# EasyEDA Pro project G-CU ver 2.3.C.eprj, schematic Schematic1
Board Name: Board1; Create Date: 2024-10-28; Page Name: P1; Project Name: G-CU ver 2.3.C; Schematic Name: Schematic1; Update Date: 2024-10-28; Company: 嘉立创EDA; Page Size: A4; Version: V1.0
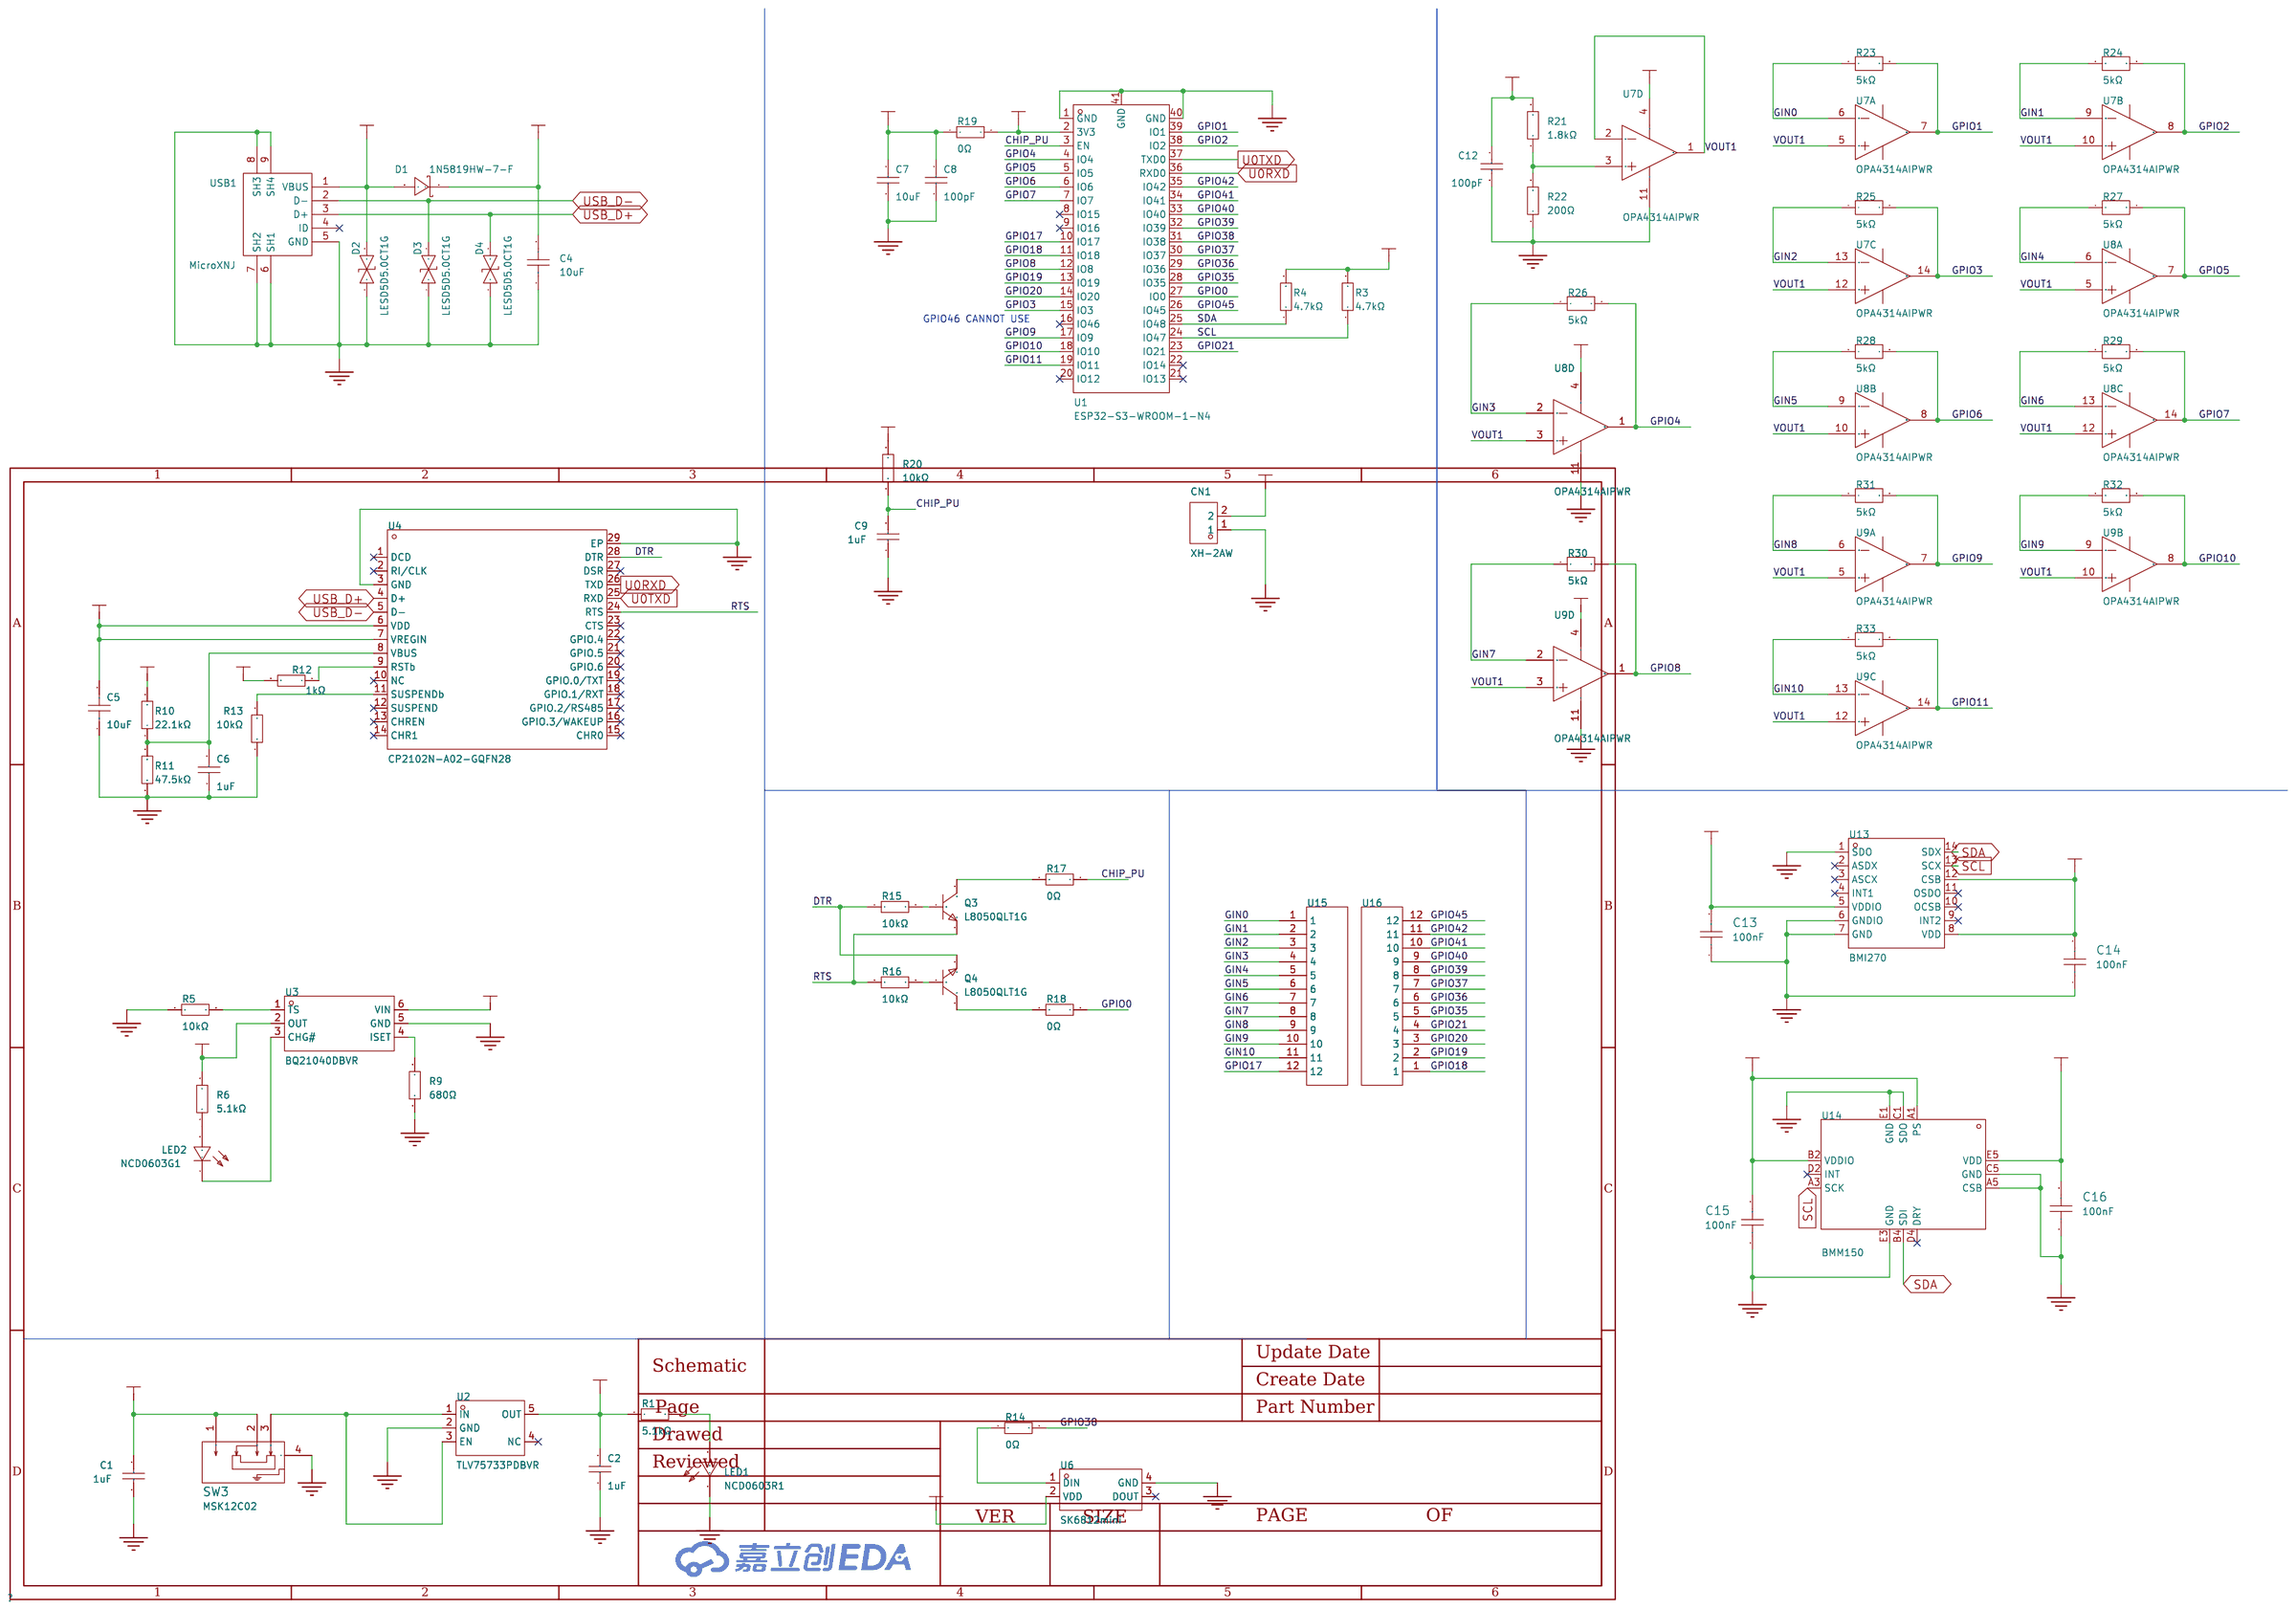
[diagram p0: schematic sheet]

## Parts
C1  1uF  [C0402]
C2  1uF  [C0402]
C4  10uF  [C0603]
C5  10uF  [C0603]
C6  1uF  [C0603]
C7  10uF  [C0402]
C8  100pF  [C0402]
C9  1uF  [C0402]
C12  100pF  [C0402]
C13  100nF  [C0402]
C14  100nF  [C0402]
C15  100nF  [C0402]
C16  100nF  [C0402]
CN1  XH-2AW  [CONN-TH_XH-2AW_C2908611]
D1  1N5819HW-7-F  [SOD-123_L2.7-W1.6-LS3.7-RD]
D2  LESD5D5.0CT1G  [SOD-523_L1.2-W0.8-LS1.6-BI]
D3  LESD5D5.0CT1G  [SOD-523_L1.2-W0.8-LS1.6-BI]
D4  LESD5D5.0CT1G  [SOD-523_L1.2-W0.8-LS1.6-BI]
LED1  NCD0603R1  [LED0603-RD_RED]
LED2  NCD0603G1  [LED0603-RD]
Q3  L8050QLT1G  [SOT-23-3_L2.9-W1.3-P1.90-LS2.4-BR]
Q4  L8050QLT1G  [SOT-23-3_L2.9-W1.3-P1.90-LS2.4-BR]
R1  5.1kΩ  [R0402]
R3  4.7kΩ  [R0402]
R4  4.7kΩ  [R0402]
R5  10kΩ  [R0402]
R6  5.1kΩ  [R0402]
R9  680Ω  [R0402]
R10  22.1kΩ  [R0402]
R11  47.5kΩ  [R0402]
R12  1kΩ  [R0402]
R13  10kΩ  [R0402]
R14  0Ω  [R0402]
R15  10kΩ  [R0402]
R16  10kΩ  [R0402]
R17  0Ω  [R0402]
R18  0Ω  [R0402]
R19  0Ω  [R0402]
R20  10kΩ  [R0402]
R21  1.8kΩ  [R0402]
R22  200Ω  [R0402]
R23  5kΩ  [R0805]
R24  5kΩ  [R0805]
R25  5kΩ  [R0805]
R26  5kΩ  [R0805]
R27  5kΩ  [R0805]
R28  5kΩ  [R0805]
R29  5kΩ  [R0805]
R30  5kΩ  [R0805]
R31  5kΩ  [R0805]
R32  5kΩ  [R0805]
R33  5kΩ  [R0805]
SW3  MSK12C02  [SW-TH_MSK12C02]
U1  ESP32-S3-WROOM-1-N4  [WIRELM-SMD_ESP32-S3-WROOM-1]
U2  TLV75733PDBVR  [SOT-23-5_L2.9-W1.6-P0.95-LS2.8-BL]
U3  BQ21040DBVR  [SOT-23-6_L2.9-W1.6-P0.95-LS2.8-BR]
U4  CP2102N-A02-GQFN28  [QFN-28_L5.0-W5.0-P0.50-TL-EP3.3]
U6  SK6812mini  [LED-SMD_4P-L3.7-W3.5-P1.75-BR-SK6812MINI]
U7  OPA4314AIPWR  [TSSOP-14_L5.0-W4.4-P0.65-LS6.4-BL]  (sections 1,2,3,4)
U8  OPA4314AIPWR  [TSSOP-14_L5.0-W4.4-P0.65-LS6.4-BL]  (sections 1,2,3,4)
U9  OPA4314AIPWR  [TSSOP-14_L5.0-W4.4-P0.65-LS6.4-BL]  (sections 1,2,3,4)
U13  BMI270  [LGA-14_L3.0-W2.5-P0.50-BR]
U14  BMM150  [WLCSP-12_L1.6-W1.6_BMM150]
U15  -  [GCU-CON ver 1.1.C]
U16  -  [GCU-CON ver 1.1.C]
USB1  MicroXNJ  [MICRO-USB-SMD_MICROXNJ]

## Library data of the parts
C1 C2 C9 = CL05A105KP5NNNC: 容值:1uF;精度:±10%;额定电压:10V;材质(温度系数):X5R;; LCSC Part Name: 1uF ±10% 10V; Supplier Part: C14445; Manufacturer: SAMSUNG(三星); Supplier Footprint: 0402; JLCPCB Part Class: Extended Part; Datasheet: https://atta.szlcsc.com/upload/public/pdf/source/20160103/1457707670698.pdf; Supplier: LCSC; Tolerance: ±10%; Voltage Rated: 10V; Temperature Coefficient: X5R
C4 C5 = CL10A106MA8NRNC: 容值:10uF;精度:±20%;额定电压:25V;材质(温度系数):X5R;; LCSC Part Name: 10uF ±20% 25V; Supplier Part: C96446; Manufacturer: SAMSUNG(三星); Supplier Footprint: 0603; JLCPCB Part Class: Basic Part; Datasheet: https://atta.szlcsc.com/upload/public/pdf/source/20170325/1490427913016.pdf; Supplier: LCSC; Tolerance: ±20%; Voltage Rated: 25V; Temperature Coefficient: X5R
C6 = CL10A105KO8NNNC: 容值:1uF;精度:±10%;额定电压:16V;材质(温度系数):X5R;; LCSC Part Name: 1uF ±10% 16V; Supplier Part: C1592; Manufacturer: SAMSUNG(三星); Supplier Footprint: 0603; JLCPCB Part Class: Extended Part; Datasheet: https://atta.szlcsc.com/upload/public/pdf/source/20220919/9FBE606BE0D9532D730F292EB26DC5BB.pdf; Supplier: LCSC; Tolerance: ±10%; Voltage Rated: 16V; Temperature Coefficient: X5R
C7 = CL05A106MQ5NUNC: 容值:10uF;精度:±20%;额定电压:6.3V;材质(温度系数):X5R;; LCSC Part Name: 10uF ±20% 6.3V; Supplier Part: C15525; Manufacturer: SAMSUNG(三星); Supplier Footprint: 0402; JLCPCB Part Class: Basic Part; Datasheet: https://atta.szlcsc.com/upload/public/pdf/source/20220823/2B02EE04F8F211D38A52DCB16EB6BEBA.pdf; Supplier: LCSC; Tolerance: ±20%; Voltage Rated: 6.3V; Temperature Coefficient: X5R
C8 C12 = 0402CG101J500NT: 容值:100pF;精度:±5%;额定电压:50V;材质(温度系数):C0G;; LCSC Part Name: 100pF ±5% 50V; Supplier Part: C1546; Manufacturer: FH(风华); Supplier Footprint: 0402; JLCPCB Part Class: Basic Part; Datasheet: https://atta.szlcsc.com/upload/public/pdf/source/20170923/C1546_1506149265265988353.pdf; Supplier: LCSC; Tolerance: ±5%; Voltage Rated: 50V; Temperature Coefficient: C0G
C13-C16 = FCC0402B104K250AT: 容值:100nF;精度:±10%;额定电压:25V;材质(温度系数):X7R;; LCSC Part Name: 100nF ±10% 25V; Supplier Part: C5137489; Manufacturer: FOJAN(富捷); Supplier Footprint: 0402; JLCPCB Part Class: 扩展库; Datasheet: https://atta.szlcsc.com/upload/public/pdf/source/20220818/0EB3B7FB2F5648AC16609637FBA7DABE.pdf; Supplier: LCSC; Tolerance: ±10%; Voltage Rated: 25V; Temperature Coefficient: X7R
CN1 = XH-2AW_C2908611: 参考系列:XH;间距:2.54mm;插针结构:1x2P;排数:1;每排PIN数:2;行距:-;公母:公型插针;安装方式:弯插;额定电流:3A;工作温度范围:-25℃~+85℃;; LCSC Part Name: XH 2.54mm 1x2P 弯插; Supplier Part: C2908611; Manufacturer: HCTL(华灿天禄); Supplier Footprint: 弯插,P=2.54mm; JLCPCB Part Class: 扩展库; Datasheet: https://atta.szlcsc.com/upload/public/pdf/source/20211021/ACA2D54D99493880102FCACAC8DAABA8.pdf; Supplier: LCSC; Reference Series: XH; Pitch: 2.54mm; Pins Structure: 1x2P; Number of Rows: 1; Number of PINs Per Row: 2; Gender: 公型插针; Mounting Style: 弯插; Current Rating (Max): 3A; Operating Temperature Range: -25℃~+85℃
D1 = 1N5819HW-7-F: 直流反向耐压(Vr):40V;平均整流电流(Io):1A;正向压降(Vf):450mV@1A;; LCSC Part Name: 40V 1A 450mV@1A; Supplier Part: C82544; Manufacturer: DIODES(美台); Supplier Footprint: SOD-123; JLCPCB Part Class: Extended Part; Datasheet: https://atta.szlcsc.com/upload/public/pdf/source/20161024/1477288459223.pdf; Supplier: LCSC; Reverse Voltage (Vr): 40V; Average Rectified Current (Io): 1A; Forward Voltage (Vf@If): 450mV@1A
D2-D4 = LESD5D5.0CT1G: 极性:双向;反向截止电压(Vrwm):5V;击穿电压(VBR):5.6V;钳位电压(Vc)@Ipp:18.6V;; LCSC Part Name: 双向ESD; Supplier Part: C383211; Manufacturer: LRC(乐山无线电); Supplier Footprint: SOD-523; JLCPCB Part Class: Extended Part; Datasheet: https://atta.szlcsc.com/upload/public/pdf/source/20190807/C383211_633DF4B4E2C161403226E5235FE33A1C.pdf; Supplier: LCSC; Polarity: 双向; Reverse Stand-Off Voltage (Vrwm): 5V; Breakdown Voltage (VBR): 5.6V; Peak Pulse Current(Ipp)@8/20us: 9.4A; Clamping Voltage@Ipp: 18.6V
LED1 = NCD0603R1_C84263: 发光颜色:红灯;; LCSC Part Name: 红灯; Supplier Part: C84263; Manufacturer: 国星光电; Supplier Footprint: 0603; JLCPCB Part Class: Extended Part; Datasheet: https://atta.szlcsc.com/upload/public/pdf/source/20200820/C84263_DABC6A75E58F576973B407FDBA283D60.pdf; Supplier: LCSC; Emitted Color: 红灯
LED2 = NCD0603G1: 发光颜色:翠绿;; LCSC Part Name: 翠绿; Supplier Part: C84267; Manufacturer: 国星光电; Supplier Footprint: 0603; JLCPCB Part Class: Extended Part; Datasheet: https://atta.szlcsc.com/upload/public/pdf/source/20200820/C84267_04BA7703640BAC111D09F5EFB971FBF3.pdf; Supplier: LCSC; Emitted Color: 翠绿
Q3 Q4 = L8050QLT1G: 晶体管类型:NPN;集射极击穿电压(Vceo):25V;集电极电流(Ic):800mA;功率(Pd):225mW;; LCSC Part Name: NPN 25V 800mA; Supplier Part: C49581; Manufacturer: LRC(乐山无线电); Supplier Footprint: SOT-23; JLCPCB Part Class: Extended Part; Datasheet: https://atta.szlcsc.com/upload/public/pdf/source/20150518/1457707314424.pdf; Supplier: LCSC; Transistor Type: NPN; Collector-Emitter Breakdown Voltage (Vceo): 25V; Collector Current (Ic): 800mA; Power Dissipation (Pd): 225mW
R1 R6 = 0402WGF5101TCE: 电阻类型:厚膜电阻;阻值:5.1kΩ;精度:±1%;功率:62.5mW;; LCSC Part Name: 5.1kΩ ±1% 62.5mW; Supplier Part: C25905; Manufacturer: UNI-ROYAL(厚声); Supplier Footprint: 0402; JLCPCB Part Class: Basic Part; Datasheet: https://atta.szlcsc.com/upload/public/pdf/source/20200306/C422600_1E6D84923E4A46A82E41ADD87F860B5C.pdf; Supplier: LCSC; Type: 厚膜电阻; Tolerance: ±1%; Power(Watts): 62.5mW; Temperature Coefficient: ±100ppm/℃; Overload Voltage (Max): 50V; Operating Temperature Range: -55℃~+155℃
R3 R4 = 0402WGF4701TCE: 电阻类型:厚膜电阻;阻值:4.7kΩ;精度:±1%;功率:62.5mW;; LCSC Part Name: 4.7kΩ ±1% 62.5mW; Supplier Part: C25900; Manufacturer: UNI-ROYAL(厚声); Supplier Footprint: 0402; JLCPCB Part Class: Basic Part; Datasheet: https://atta.szlcsc.com/upload/public/pdf/source/20200306/C422600_1E6D84923E4A46A82E41ADD87F860B5C.pdf; Supplier: LCSC; Type: 厚膜电阻; Tolerance: ±1%; Power(Watts): 62.5mW; Temperature Coefficient: ±100ppm/℃; Overload Voltage (Max): 50V; Operating Temperature Range: -55℃~+155℃
R5 R13 R15 R16 R20 = 0402WGF1002TCE: 电阻类型:厚膜电阻;阻值:10kΩ;精度:±1%;功率:62.5mW;; LCSC Part Name: 10kΩ ±1% 62.5mW; Supplier Part: C25744; Manufacturer: UNI-ROYAL(厚声); Supplier Footprint: 0402; JLCPCB Part Class: Basic Part; Datasheet: https://atta.szlcsc.com/upload/public/pdf/source/20200306/C422600_1E6D84923E4A46A82E41ADD87F860B5C.pdf; Supplier: LCSC; Type: 厚膜电阻; Tolerance: ±1%; Power(Watts): 62.5mW; Temperature Coefficient: ±100ppm/℃; Overload Voltage (Max): 50V; Operating Temperature Range: -55℃~+155℃
R9 = 0402WGF6800TCE: 电阻类型:厚膜电阻;阻值:680Ω;精度:±1%;功率:62.5mW;; LCSC Part Name: 680Ω ±1% 62.5mW; Supplier Part: C25130; Manufacturer: UNI-ROYAL(厚声); Supplier Footprint: 0402; JLCPCB Part Class: Basic Part; Datasheet: https://atta.szlcsc.com/upload/public/pdf/source/20200306/C422600_1E6D84923E4A46A82E41ADD87F860B5C.pdf; Supplier: LCSC; Type: 厚膜电阻; Tolerance: ±1%; Power(Watts): 62.5mW; Temperature Coefficient: ±100ppm/℃; Overload Voltage (Max): 50V; Operating Temperature Range: -55℃~+155℃
R10 = 0402WGF2212TCE: 电阻类型:厚膜电阻;阻值:22.1kΩ;精度:±1%;功率:62.5mW;; LCSC Part Name: 22.1kΩ ±1% 62.5mW; Supplier Part: C43473; Manufacturer: UNI-ROYAL(厚声); Supplier Footprint: 0402; JLCPCB Part Class: Extended Part; Datasheet: https://atta.szlcsc.com/upload/public/pdf/source/20200306/C422600_1E6D84923E4A46A82E41ADD87F860B5C.pdf; Supplier: LCSC; Type: 厚膜电阻; Tolerance: ±1%; Power(Watts): 62.5mW; Temperature Coefficient: ±100ppm/℃; Overload Voltage (Max): 50V; Operating Temperature Range: -55℃~+155℃
R11 = 0402WGF4752TCE: 电阻类型:厚膜电阻;阻值:47.5kΩ;精度:±1%;功率:62.5mW;; LCSC Part Name: 47.5kΩ ±1% 62.5mW; Supplier Part: C25896; Manufacturer: UNI-ROYAL(厚声); Supplier Footprint: 0402; JLCPCB Part Class: Extended Part; Datasheet: https://atta.szlcsc.com/upload/public/pdf/source/20200306/C422600_1E6D84923E4A46A82E41ADD87F860B5C.pdf; Supplier: LCSC; Type: 厚膜电阻; Tolerance: ±1%; Power(Watts): 62.5mW; Temperature Coefficient: ±100ppm/℃; Overload Voltage (Max): 50V; Operating Temperature Range: -55℃~+155℃
R12 = 0402WGF1001TCE: 电阻类型:厚膜电阻;阻值:1kΩ;精度:±1%;功率:62.5mW;; LCSC Part Name: 1kΩ ±1% 62.5mW; Supplier Part: C11702; Manufacturer: UNI-ROYAL(厚声); Supplier Footprint: 0402; JLCPCB Part Class: Basic Part; Datasheet: https://atta.szlcsc.com/upload/public/pdf/source/20200306/C422600_1E6D84923E4A46A82E41ADD87F860B5C.pdf; Supplier: LCSC; Type: 厚膜电阻; Tolerance: ±1%; Power(Watts): 62.5mW; Temperature Coefficient: ±100ppm/℃; Overload Voltage (Max): 50V; Operating Temperature Range: -55℃~+155℃
R14 R17-R19 = 0402WGJ0000TCE: 电阻类型:厚膜电阻;阻值:0Ω;精度:±5%;功率:62.5mW;; LCSC Part Name: 0Ω ±5% 62.5mW; Supplier Part: C21376; Manufacturer: UNI-ROYAL(厚声); Supplier Footprint: 0402; JLCPCB Part Class: Extended Part; Datasheet: https://atta.szlcsc.com/upload/public/pdf/source/20200306/C422600_1E6D84923E4A46A82E41ADD87F860B5C.pdf; Supplier: LCSC; Type: 厚膜电阻; Tolerance: ±5%; Power(Watts): 62.5mW; Overload Voltage (Max): 50V; Operating Temperature Range: -55℃~+155℃
R21 = 0402WGF1801TCE: 电阻类型:厚膜电阻;阻值:1.8kΩ;精度:±1%;功率:62.5mW;; LCSC Part Name: 1.8kΩ ±1% 62.5mW; Supplier Part: C25871; Manufacturer: UNI-ROYAL(厚声); Supplier Footprint: 0402; JLCPCB Part Class: Extended Part; Datasheet: https://atta.szlcsc.com/upload/public/pdf/source/20200306/C422600_1E6D84923E4A46A82E41ADD87F860B5C.pdf; Supplier: LCSC; Type: 厚膜电阻; Tolerance: ±1%; Power(Watts): 62.5mW; Temperature Coefficient: ±100ppm/℃; Overload Voltage (Max): 50V; Operating Temperature Range: -55℃~+155℃
R22 = 0402WGF2000TCE: 电阻类型:厚膜电阻;阻值:200Ω;精度:±1%;功率:62.5mW;; LCSC Part Name: 200Ω ±1% 62.5mW; Supplier Part: C25087; Manufacturer: UNI-ROYAL(厚声); Supplier Footprint: 0402; JLCPCB Part Class: Basic Part; Datasheet: https://atta.szlcsc.com/upload/public/pdf/source/20200306/C422600_1E6D84923E4A46A82E41ADD87F860B5C.pdf; Supplier: LCSC; Type: 厚膜电阻; Tolerance: ±1%; Power(Watts): 62.5mW; Temperature Coefficient: ±100ppm/℃; Overload Voltage (Max): 50V; Operating Temperature Range: -55℃~+155℃
R23-R33 = AR03BTCX5001: 电阻类型:薄膜电阻;阻值:5kΩ;精度:±0.1%;功率:100mW;; LCSC Part Name: 5kΩ ±0.1% 100mW; Supplier Part: C2828621; Manufacturer: Viking(光颉); Supplier Footprint: 0603; JLCPCB Part Class: Extended Part; Datasheet: https://atta.szlcsc.com/upload/public/pdf/source/20211009/C2828621_7F88408CB1D09DFC08036051E0A6050B.pdf; Supplier: LCSC; Type: 薄膜电阻; Tolerance: ±0.1%; Power(Watts): 100mW; Temperature Coefficient: ±25ppm/℃; Overload Voltage (Max): 50V; Operating Temperature Range: -55℃~+155℃
SW3 = MSK12C02: LCSC Part Name: 两档侧拨贴片 7脚 拨动 白柄 柄长1.5mm,带定位柱; Supplier Part: C431540; Manufacturer: SHOU HAN(首韩); Supplier Footprint: SMD; JLCPCB Part Class: 扩展库; Supplier: LCSC
U1 = ESP32-S3-WROOM-1: LCSC Part Name: ESP32-S2-SOLO-2-N4; Supplier Part: C2913197; Manufacturer: ESPRESSIF(乐鑫); JLCPCB Part Class: Extended Part; Datasheet: https://atta.szlcsc.com/upload/public/pdf/source/20220829/68E69EF550BFD22B9418B9E05FF4E453.pdf; Supplier: LCSC
U2 = TLV75733PDBVR: 输出类型:固定;输出极性:正;输出通道数:1;最大输入电压:5.5V;输出电压:3.3V;压差:475mV@(1A);输出电流:1A;电源纹波抑制比(PSRR):52dB;; LCSC Part Name: 正 Vin=5.5V Vout=3.3V 1A 52dB; Supplier Part: C485517; Manufacturer: TI(德州仪器); Supplier Footprint: SOT-23-5; JLCPCB Part Class: Extended Part; Datasheet: https://atta.szlcsc.com/upload/public/pdf/source/20200225/C485517_6B29D09EDAFD9A781E45EE8E3C6E09A4.pdf; Supplier: LCSC; Output Type: 固定; Output Polarity: 正; Number of Outputs: 1; Maximum Input Voltage: 5.5V; Output Voltage: 3.3V; Dropout Voltage: 475mV@(1A); Output Current: 1A; Power Supply Rejection Ratio (PSRR): 52dB
U3 = BQ21040DBVR: 电池类型:锂离子/聚合物;电池节数:1;最大充电电流:800mA;电源电压:6.45V;; Supplier Part: C202311; Manufacturer: TI(德州仪器); Supplier Footprint: SOT-23-6; JLCPCB Part Class: Extended Part; Datasheet: https://atta.szlcsc.com/upload/public/pdf/source/20180412/C202311_69E9FC455D67F52C33ED3C60972DCB90.pdf; Supplier: LCSC; Type of Battery: 锂离子/聚合物; Number of Cells: 1; Maximum Charge Current: 800mA; Supply Voltage: 6.45V; Operating Temperature: 0℃~+125℃
U4 = CP2102N-A02-GQFN28: Supplier Part: C1550553; Manufacturer: SILICON LABS(芯科); Supplier Footprint: QFN-28(5x5); JLCPCB Part Class: Extended Part; Datasheet: https://atta.szlcsc.com/upload/public/pdf/source/20201204/C964632_F2B790CC23A72455AEF523510305B30A.pdf; Supplier: LCSC
U6 = SK6812mini: Supplier Part: C2886570; Manufacturer: 欧思科光电; Supplier Footprint: SMD; JLCPCB Part Class: Extended Part; Datasheet: https://atta.szlcsc.com/upload/public/pdf/source/20230417/4A68877D1EE94768BDE7A1DE8196F30D.pdf; Supplier: LCSC
U7-U9 = OPA4314AIPWR: OPA4314 四路、3MHz、低功耗、低噪声、RRI/O、1.8V CMOS 运算放大器; Supplier Part: C129333; Manufacturer: TI(德州仪器); Supplier Footprint: TSSOP-14; JLCPCB Part Class: Extended Part; Datasheet: https://atta.szlcsc.com/upload/public/pdf/source/20170914/C129333_1505359967979968173.pdf; Supplier: LCSC
U13 = BMI270: IMU-惯性测量单元; Supplier Part: C2836813; Manufacturer: Bosch(博世); Supplier Footprint: LGA-14(2.5x3); JLCPCB Part Class: 扩展库; Datasheet: https://atta.szlcsc.com/upload/public/pdf/source/20210625/C2836813_35E1F3F92097F45A3828DF13DDBA01A5.pdf; Supplier: LCSC
U14 = BMM150: 磁传感器 3轴磁罗盘; LCSC Part Name: 三轴地磁式传感器; Supplier Part: C171681; Manufacturer: Bosch(博世); Supplier Footprint: WLCSP-12; JLCPCB Part Class: 扩展库; Datasheet: https://atta.szlcsc.com/upload/public/pdf/source/20180327/C171681_AC95244FE88EF9D8F701E0ABF38F9AC1.pdf; Supplier: LCSC
U15 U16 = CON ver 1.1.C
USB1 = MicroXNJ: 连接器类型:Micro-B;标准:USB 2.0;公母:母座;触点数量:5;端口数量:1;安装方式:卧贴;额定电流 - 电源:1A;工作温度范围:-20℃~+85℃;; LCSC Part Name: Micro-B 母座 卧贴; Supplier Part: C404969; Manufacturer: SHOU HAN(首韩); Supplier Footprint: SMD; JLCPCB Part Class: Extended Part; Datasheet: https://atta.szlcsc.com/upload/public/pdf/source/20220415/2494EDFF499AF6F852F7C820374B6AF3.pdf; Supplier: LCSC; Connector Type: Micro-B; Standard: USB 2.0; Gender: 母座; Number of Contacts: 5; Number of Ports: 1; Mounting Style: 卧贴; Current Rating - Power (Max): 1A; Operating Temperature Range: -20℃~+85℃

## Nets
GND: C1.1 C2.1 C4.1 C5.1 C6.1 C7.1 C8.1 C9.1 C12.2 C13.1 C14.1 C15.1 C16.1 CN1.1 D2.1 D3.1 D4.1 LED1.1(K) R5.1 R9.1 R11.1 R13.1 R22.1 SW3.4 U1.1(GND) U1.40(GND) U1.41(GND) U2.2(GND) U3.5(GND) U4.3(GND) U4.29(EP) U6.4(GND) U7.11(V-) U8.11(V-) U9.11(V-) U13.1(SDO) U13.6(GNDIO) U13.7(GND) U14.A5(CSB) U14.C1(SDO) U14.C5(GND) U14.E1(GND) U14.E3(GND) USB1.5(GND) USB1.6(SH1) USB1.7(SH2) USB1.8(SH3) USB1.9(SH4)
VBAT: C1.2 CN1.2 R6.2 SW3.1 SW3.2 U3.2(OUT)
VBUS: D1.2(A) D2.2 R10.2 U3.6(VIN) USB1.1(VBUS)
VCC_3V3: C2.2 C5.2 C7.2 C8.2 C12.1 C13.2 C14.2 C15.2 C16.2 R1.1 R3.2 R4.2 R12.2 R19.1 R21.2 U2.5(OUT) U4.6(VDD) U4.7(VREGIN) U6.2(VDD) U7.4(V+) U8.4(V+) U9.4(V+) U13.5(VDDIO) U13.8(VDD) U13.12(CSB) U14.A1(PS) U14.B2(VDDIO) U14.E5(VDD)
VCC_5V: C4.2 D1.1(K)
CHIP_PU: C9.2 R17.2 R20.1 U1.3(EN)
DTR: Q4.2(E) R15.1 U4.28(DTR)
ESP_3V3: R19.2 R20.2 U1.2(3V3)
GIN0: R23.1 U7.6(IN B-) U15.1
GIN1: R24.1 U7.9(IN C-) U15.2
GIN2: R25.1 U7.13(IN D-) U15.3
GIN3: R26.1 U8.2(IN A-) U15.4
GIN4: R27.1 U8.6(IN B-) U15.5
GIN5: R28.1 U8.9(IN C-) U15.6
GIN6: R29.1 U8.13(IN D-) U15.7
GIN7: R30.1 U9.2(IN A-) U15.8
GIN8: R31.1 U9.6(IN B-) U15.9
GIN9: R32.1 U9.9(IN C-) U15.10
GIN10: R33.1 U9.13(IN D-) U15.11
GPIO0: R18.2 U1.27(IO0)
GPIO1: R23.2 U1.39(IO1) U7.7(OUT B)
GPIO2: R24.2 U1.38(IO2) U7.8(OUT C)
GPIO3: R25.2 U1.15(IO3) U7.14(OUT D)
GPIO4: R26.2 U1.4(IO4) U8.1(OUT A)
GPIO5: R27.2 U1.5(IO5) U8.7(OUT B)
GPIO6: R28.2 U1.6(IO6) U8.8(OUT C)
GPIO7: R29.2 U1.7(IO7) U8.14(OUT D)
GPIO8: R30.2 U1.12(IO8) U9.1(OUT A)
GPIO9: R31.2 U1.17(IO9) U9.7(OUT B)
GPIO10: R32.2 U1.18(IO10) U9.8(OUT C)
GPIO11: R33.2 U1.19(IO11) U9.14(OUT D)
GPIO17: U1.10(IO17) U15.12
GPIO18: U1.11(IO18) U16.1
GPIO19: U1.13(IO19) U16.2
GPIO20: U1.14(IO20) U16.3
GPIO21: U1.23(IO21) U16.4
GPIO35: U1.28(IO35) U16.5
GPIO36: U1.29(IO36) U16.6
GPIO37: U1.30(IO37) U16.7
GPIO38: R14.2 U1.31(IO38)
GPIO39: U1.32(IO39) U16.8
GPIO40: U1.33(IO40) U16.9
GPIO41: U1.34(IO41) U16.10
GPIO42: U1.35(IO42) U16.11
GPIO45: U1.26(IO45) U16.12
RTS: Q3.2(E) R16.1 U4.24(RTS)
SCL: R3.1 U1.24(IO47) U13.13(SCX) U14.A3(SCK)
SDA: R4.1 U1.25(IO48) U13.14(SDX) U14.B4(SDI)
U0RXD: U1.36(RXD0) U4.26(TXD)
U0TXD: U1.37(TXD0) U4.25(RXD)
USB_D+: D4.2 U4.4(D+) USB1.3(D+)
USB_D-: D3.2 U4.5(D-) USB1.2(D-)
VOUT1: U7.1(OUT A) U7.2(IN A-) U7.5(IN B+) U7.10(IN C+) U7.12(IN D+) U8.3(IN A+) U8.5(IN B+) U8.10(IN C+) U8.12(IN D+) U9.3(IN A+) U9.5(IN B+) U9.10(IN C+) U9.12(IN D+)
$1N2540: LED1.2(A) R1.2
$1N5698: R5.2 U3.1(TS)
$1N5744: LED2.2(A) R6.1
$1N5776: LED2.1(K) U3.3(CHG#)
$1N6032: R9.2 U3.4(ISET)
$1N7305: C6.2 R10.1 R11.2 U4.8(VBUS)
$1N7502: R12.1 U4.9(RSTb)
$1N7540: R13.2 U4.11(SUSPENDb)
$1N7794: R14.1 U6.1(DIN)
$1N8190: Q3.3(C) R17.1
$1N8194: Q4.3(C) R18.1
$1N8229: Q3.1(B) R15.2
$1N8232: Q4.1(B) R16.2
$1N11489: R21.1 R22.2 U7.3(IN A+)
$1N12314: SW3.3 U2.1(IN) U2.3(EN)

Not connected (* = marked no-connect by the designer): U1 8(IO15)* 9(IO16)* 16(IO46)* 20(IO12)* 21(IO13)* 22(IO14)*; U2 4(NC)*; U4 1(DCD)* 2(RI/CLK)* 10(NC)* 12(SUSPEND)* 13(CHREN)* 14(CHR1)* 15(CHR0)* 16(GPIO.3/WAKEUP)* 17(GPIO.2/RS485)* 18(GPIO.1/RXT)* 19(GPIO.0/TXT)* 20(GPIO.6)* 21(GPIO.5)* 22(GPIO.4)* 23(CTS)* 27(DSR)*; U6 3(DOUT)*; U13 2(ASDX)* 3(ASCX)* 4(INT1)* 9(INT2)* 10(OCSB)* 11(OSDO)*; U14 D2(INT)* D4(DRY)*; USB1 4(ID)*

## Notes on the sheet
- GPIO46 CANNOT USE
